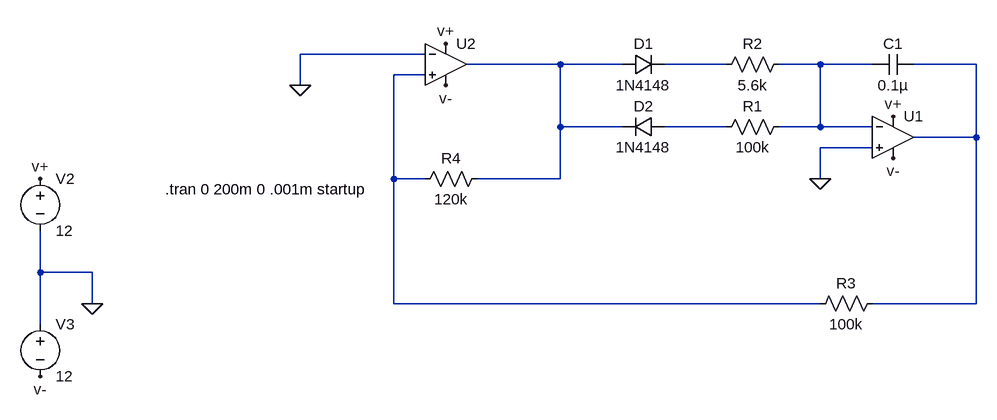
[diagram p0: schematic diemte de sierra.asc]
diemte de sierra.asc, the LTspice schematic file:
Version 4
SHEET 1 1748 680
WIRE 784 -224 592 -224
WIRE 992 -208 848 -208
WIRE 1088 -208 992 -208
WIRE 1248 -208 1152 -208
WIRE 1392 -208 1328 -208
WIRE 1472 -208 1392 -208
WIRE 1632 -208 1536 -208
WIRE 784 -192 736 -192
WIRE 592 -176 592 -224
WIRE 992 -112 992 -208
WIRE 1088 -112 992 -112
WIRE 1248 -112 1152 -112
WIRE 1392 -112 1392 -208
WIRE 1392 -112 1328 -112
WIRE 1472 -112 1392 -112
WIRE 1632 -96 1632 -208
WIRE 1632 -96 1536 -96
WIRE 1472 -80 1392 -80
WIRE 736 -32 736 -192
WIRE 784 -32 736 -32
WIRE 992 -32 992 -112
WIRE 992 -32 864 -32
WIRE 1392 -32 1392 -80
WIRE 192 112 192 48
WIRE 272 112 192 112
WIRE 272 160 272 112
WIRE 736 160 736 -32
WIRE 1392 160 736 160
WIRE 1632 160 1632 -96
WIRE 1632 160 1472 160
WIRE 192 192 192 112
FLAG 272 160 0
FLAG 192 -32 v+
FLAG 1504 -128 v+
FLAG 816 -240 v+
FLAG 192 272 v-
FLAG 816 -176 v-
FLAG 1504 -64 v-
FLAG 1392 -32 0
FLAG 592 -176 0
SYMBOL diode 1088 -192 R270
WINDOW 0 32 32 VTop 2
WINDOW 3 0 32 VBottom 2
SYMATTR InstName D1
SYMATTR Value 1N4148
SYMBOL diode 1152 -128 R90
WINDOW 0 0 32 VBottom 2
WINDOW 3 32 32 VTop 2
SYMATTR InstName D2
SYMATTR Value 1N4148
SYMBOL Opamps\\UniversalOpamp2 1504 -96 R0
SYMATTR InstName U1
SYMBOL Opamps\\UniversalOpamp2 816 -208 R0
SYMATTR InstName U2
SYMBOL voltage 192 -48 R0
WINDOW 123 0 0 Left 2
WINDOW 39 0 0 Left 2
SYMATTR InstName V2
SYMATTR Value 12
SYMBOL voltage 192 176 R0
WINDOW 123 0 0 Left 2
WINDOW 39 0 0 Left 2
SYMATTR InstName V3
SYMATTR Value 12
SYMBOL res 1344 -128 R90
WINDOW 0 0 56 VBottom 2
WINDOW 3 32 56 VTop 2
SYMATTR InstName R1
SYMATTR Value 100k
SYMBOL res 1344 -224 R90
WINDOW 0 0 56 VBottom 2
WINDOW 3 32 56 VTop 2
SYMATTR InstName R2
SYMATTR Value 5.6k
SYMBOL cap 1536 -224 R90
WINDOW 0 0 32 VBottom 2
WINDOW 3 32 32 VTop 2
SYMATTR InstName C1
SYMATTR Value 0.1µ
SYMBOL res 1488 144 R90
WINDOW 0 0 56 VBottom 2
WINDOW 3 32 56 VTop 2
SYMATTR InstName R3
SYMATTR Value 100k
SYMBOL res 880 -48 R90
WINDOW 0 0 56 VBottom 2
WINDOW 3 32 56 VTop 2
SYMATTR InstName R4
SYMATTR Value 120k
TEXT 384 -16 Left 2 !.tran 0 200m 0 .001m startup

The netlist it stands for:
* diemte de sierra.asc
D1 N001 N002 1N4148
D2 N006 N001 1N4148
XU1 0 N003 v+ v- N004 level.2 Avol=1Meg GBW=10Meg Slew=10Meg ilimit=25m rail=0 Vos=0 phimargin=45 en=0 enk=0 in=0 ink=0 Rin=500Meg  ; pins IN+ IN- V+ V- OUT
XU2 N005 0 v+ v- N001 level.2 Avol=1Meg GBW=10Meg Slew=10Meg ilimit=25m rail=0 Vos=0 phimargin=45 en=0 enk=0 in=0 ink=0 Rin=500Meg  ; pins IN+ IN- V+ V- OUT
V2 v+ 0 12
V3 0 v- 12
R1 N003 N006 100k
R2 N003 N002 5.6k
C1 N004 N003 0.1µ
R3 N004 N005 100k
R4 N001 N005 120k
.model D D
.lib standard.dio
.tran 0 200m 0 .001m startup
.lib UniversalOpamps2.sub
.backanno
.end